# Altium schematic sheet Sch_Sh2.SchDoc
size A
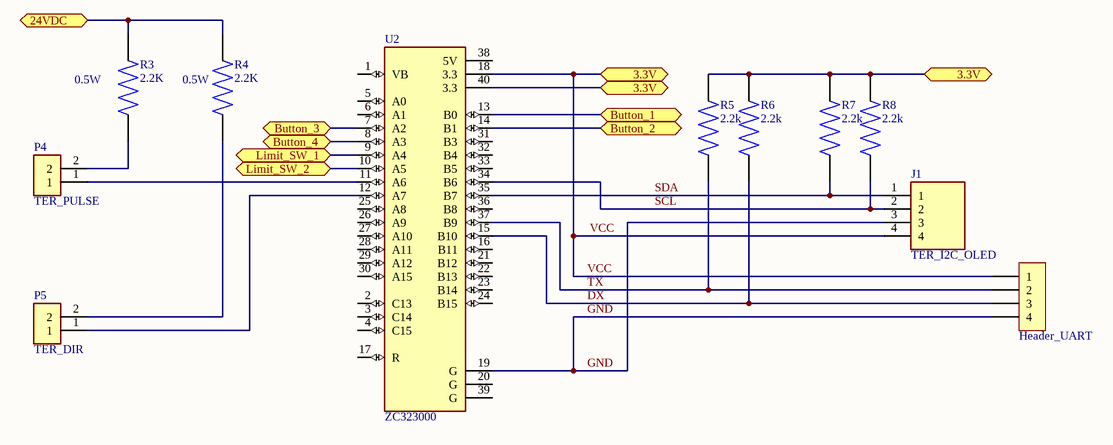
[diagram p0: Sch_Sh2.SchDoc]

## Parts
H1  Header_UART  [XH2.54M-4]
J1  Comment_1: TER_I2C_OLED  [TE_1546215-4]  (hidden comment: 1546215-4)
P4  Comment_1: TER_PULSE  [TE_282837-2]  (hidden comment: 282837-2)
P5  Comment_1: TER_DIR  [TE_282837-2]  (hidden comment: 282837-2)
R3  2.2K  [RES_ERJP06J202V]
R4  2.2K  [RES_ERJP06J202V]
R5  2.2k  [RES_ERJP06J202V]
R6  2.2k  [RES_ERJP06J202V]
R7  2.2k  [RES_ERJP06J202V]
R8  2.2k  [RES_ERJP06J202V]
U2  ZC323000  [MODULE_ZC323000]

## Ports
3.3V, 24VDC, Button_1, Button_2, Button_3, Button_4, Limit_SW_1, Limit_SW_2

## Nets
24VDC: R3.2 R4.2 ; port 24VDC
Button_1: U2.13(B0) ; port Button_1
Button_2: U2.14(B1) ; port Button_2
Button_3: U2.7(A2) ; port Button_3
Button_4: U2.8(A3) ; port Button_4
DX: H1.3 R6.1 U2.15(B10)
GND: H1.4 J1.3 U2.19(G)
Limit_SW_1: U2.9(A4) ; port Limit_SW_1
Limit_SW_2: U2.10(A5) ; port Limit_SW_2
SCL: J1.2 R8.1 U2.34(B6)
SDA: J1.1 R7.1 U2.35(B7)
TX: H1.2 R5.1 U2.37(B9)
VCC: H1.1 J1.4 R5.2 R6.2 R7.2 R8.2 U2.18(3.3) U2.40(3.3) ; port 3.3V
NetP4_1: P4.1 U2.11(A6)
NetP4_2: P4.2 R3.1
NetP5_1: P5.1 U2.12(A7)
NetP5_2: P5.2 R4.1

Not connected (* = marked no-connect by the designer): U2 1(VB) 2(C13) 3(C14) 4(C15) 5(A0) 6(A1) 16(B11) 17(R) 20(G) 21(B12) 22(B13) 23(B14) 24(B15) 25(A8) 26(A9) 27(A10) 28(A11) 29(A12) 30(A15) 31(B3) 32(B4) 33(B5) 36(B8) 38(5V) 39(G)

## Notes on the sheet
- (in symbol ERJP06J202V) 0.5W

## Library data of the parts
H1 = Header 4P 2.54 Duc Thang: Cắm; Ten_Linh_Kien: Header 4P XH2.54-4P Đực Thẳng; Don_Vi: Con; Ma_Hang: MH001285; Chung_Loai: Cắm
J1 = 1546215-4: Conn Terminal Block 4 POS 2.54mm Solder ST Thru-Hole; MF: TE Connectivity; Check_prices: https://www.snapeda.com/parts/1546215-4/TE+Connectivity+AMP+Connectors/view-part/?ref=eda; Value: *; Availability: In Stock; MP: 1546215-4; Price: None; Package: None; SnapEDA_Link: https://www.snapeda.com/parts/1546215-4/TE+Connectivity+AMP+Connectors/view-part/?ref=snap; Purchase-URL: https://pricing.snapeda.com/search/part/1546215-4/?ref=eda
P4 P5 = 282837-2: Connector Terminal Blocks Receptacle 2 Position 5.08mm Solder Straight Thru-Hole 13.5A/Contact; MF: TE Connectivity; Check_prices: https://www.snapeda.com/parts/282837-2/TE+Connectivity+AMP+Connectors/view-part/?ref=eda; Value: *; Availability: In Stock; MP: 282837-2; Price: None; Package: None; SnapEDA_Link: https://www.snapeda.com/parts/282837-2/TE+Connectivity+AMP+Connectors/view-part/?ref=snap; Purchase-URL: https://pricing.snapeda.com/search/part/282837-2/?ref=eda
R3-R8 = ERJP06J202V: Value: *; Package: None; MP: ERJP06J202V; Price: None; Availability: Unavailable
U2 = ZC323000: STM32F103C8T6 ARM STM32 Minimum System Development Board Module For Arduino; Package: None; MP: ZC323000; Value: *; Availability: Unavailable; Price: None